# EasyEDA schematic SCH_OpenOllie_2026-02-20.json
TITLE: OO_CHRG; REV: 1; Date: 2025-11-22; Sheet: 1/1; Drawn By: Ellie; Company: EPU-LABS
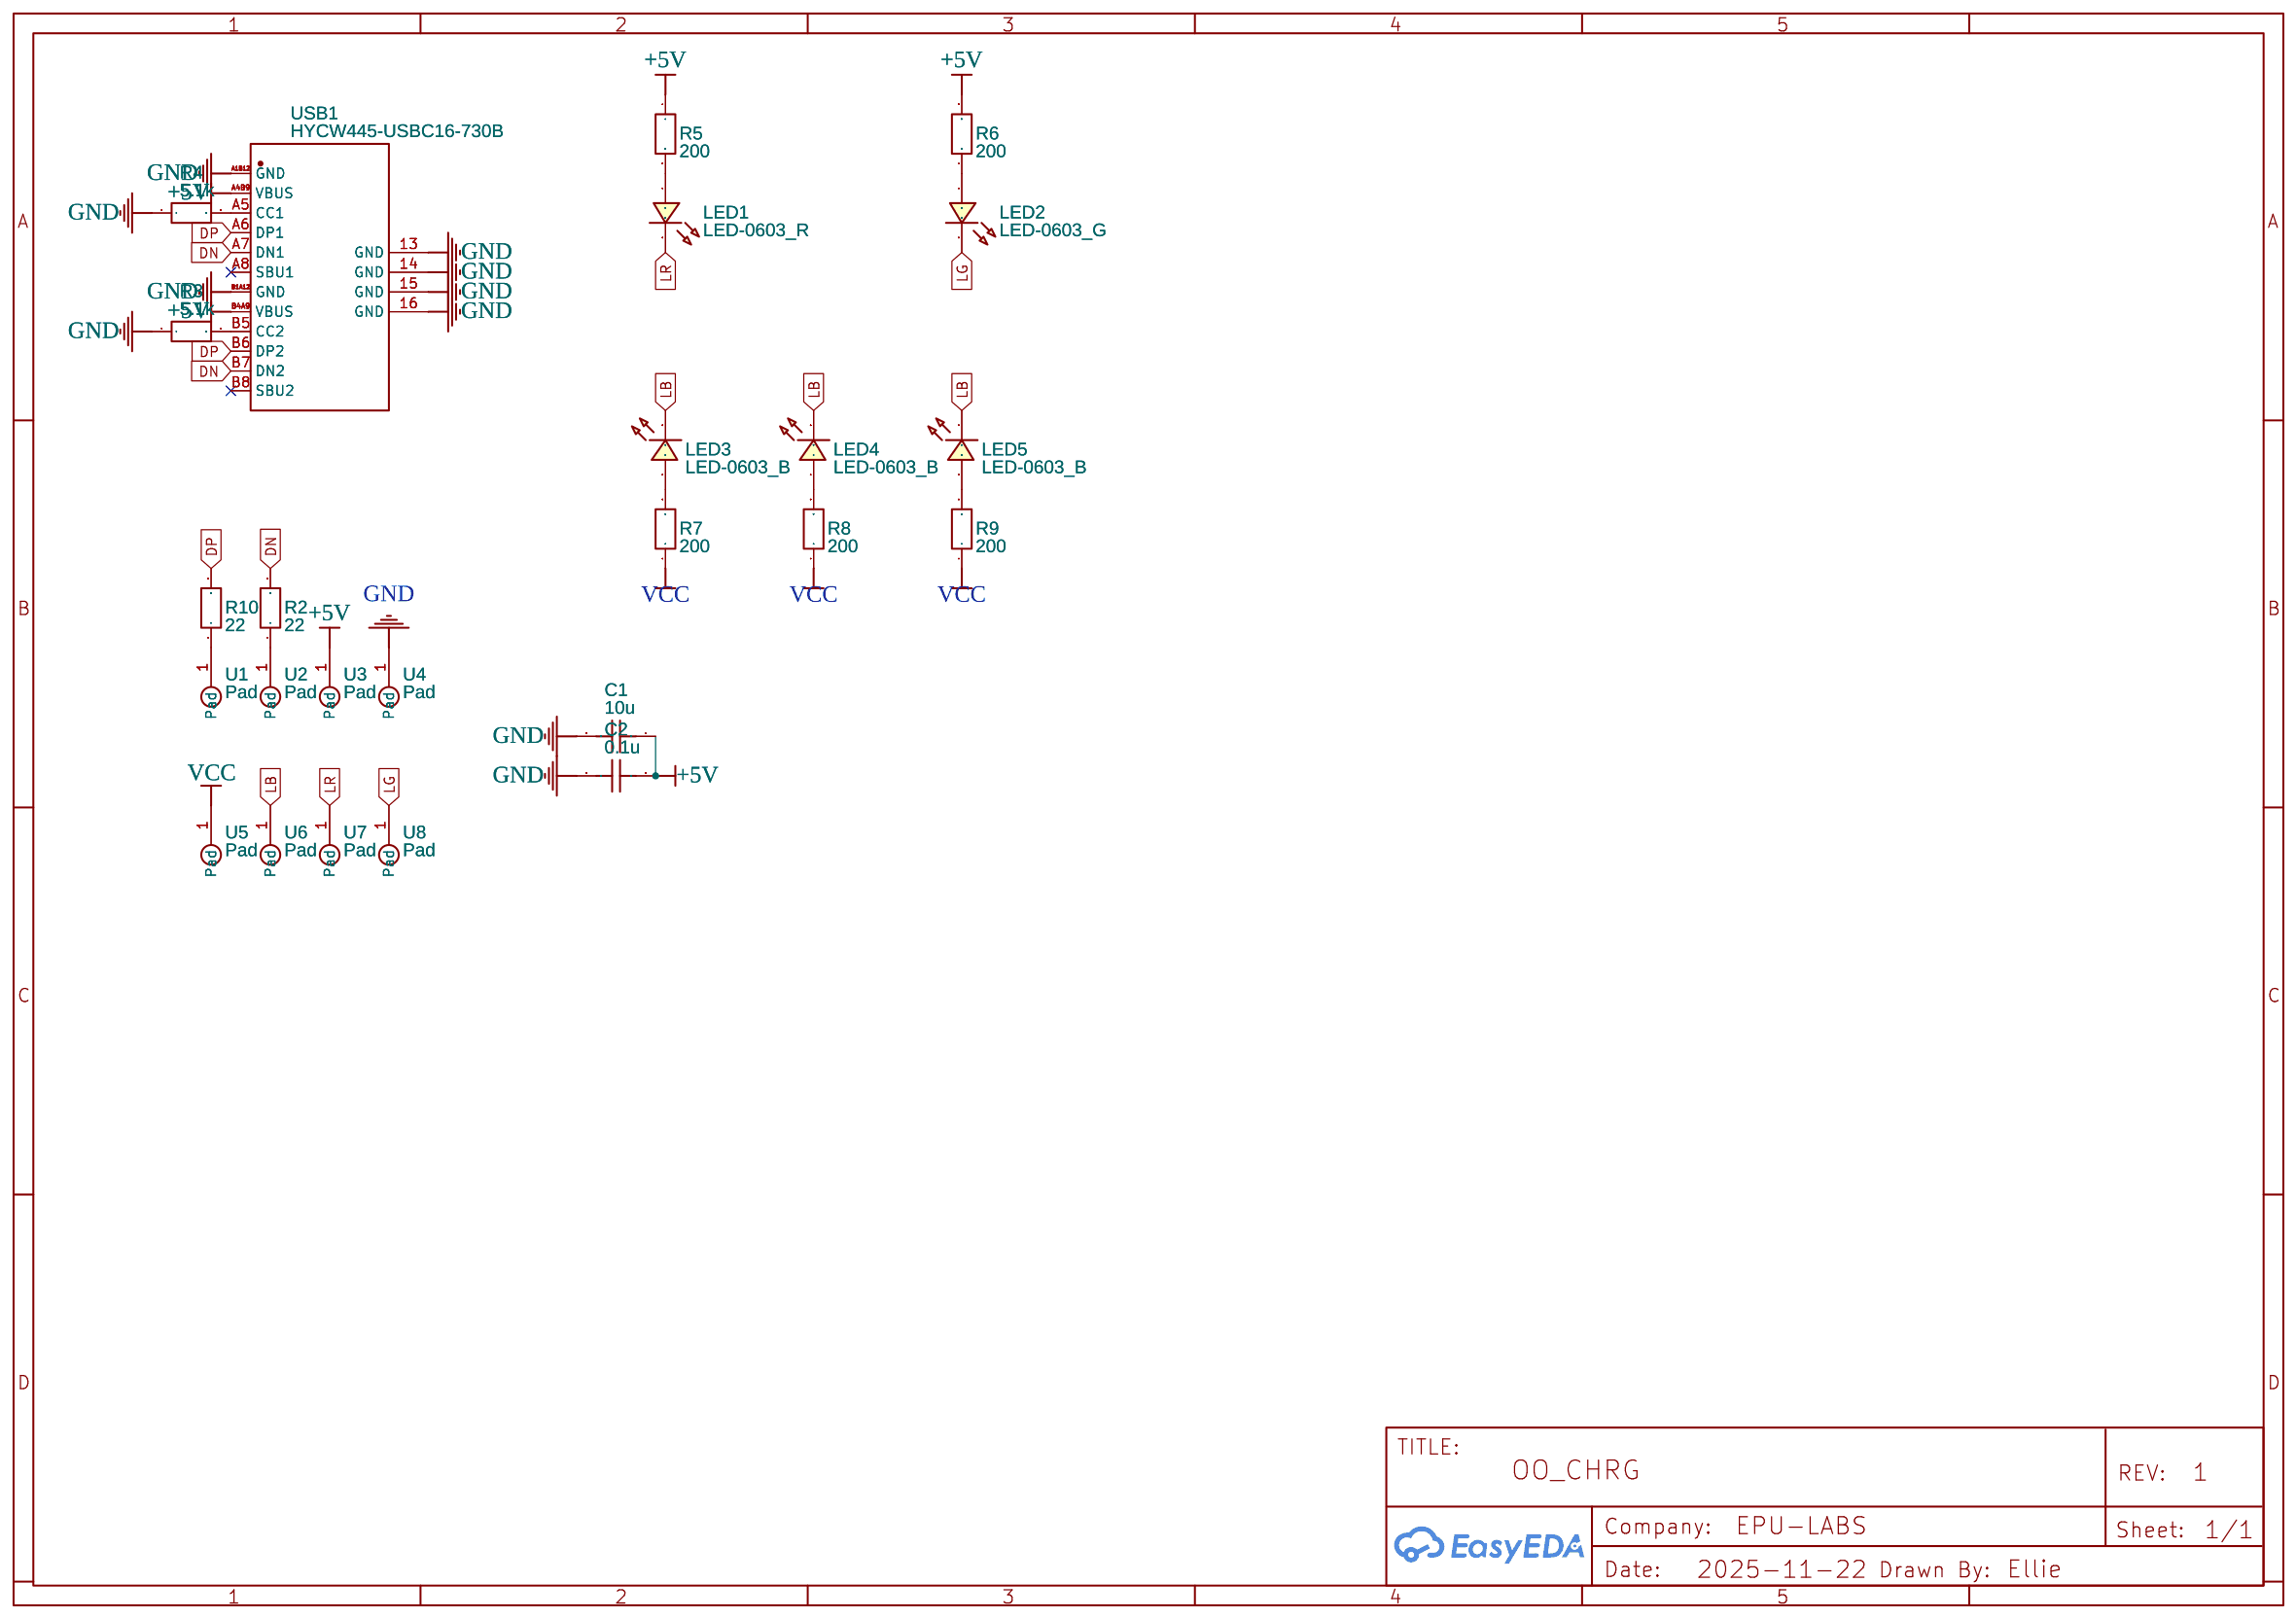
[diagram p0: schematic sheet]

## Parts
C1  10u  [C0603]
C2  0.1u  [C0402]
LED1  LED-0603_R  [LED0603_RED]
LED2  LED-0603_G  [LED0603_GREEN]
LED3  LED-0603_B  [LED0603_BLUE]
LED4  LED-0603_B  [LED0603_BLUE]
LED5  LED-0603_B  [LED0603_BLUE]
R2  22  [R0402]
R3  5.1k  [R0402]
R4  5.1k  [R0402]
R5  200  [R0402]
R6  200  [R0402]
R7  200  [R0402]
R8  200  [R0402]
R9  200  [R0402]
R10  22  [R0402]
U1  Pad  [PADPAD]
U2  Pad  [PADPAD]
U3  Pad  [PADPAD]
U4  Pad  [PADPAD]
U5  Pad  [PADPAD]
U6  Pad  [PADPAD]
U7  Pad  [PADPAD]
U8  Pad  [PADPAD]
USB1  HYCW445-USBC16-730B  [USB-TYPE-C-SMD_TYPE-C-16P-USB616FC]

## Library data of the parts
C1 = C_0805_US: Contributor: LCEDA_Lib
C2 = C_0402_US: Contributor: LCEDA_Lib
LED1 = LED-0603_R: Manufacturer: EVERLIGHT(台湾亿光); Manufacturer Part: 19-217/R6C-AL1M2VY/3T; Supplier Part: C72044; Supplier: LCSC; Contributor: LCEDA_01
LED2 = LED-0603_G: Manufacturer: EVERLIGHT(台湾亿光); Manufacturer Part: 19-217/GHC-YR1S2/3T; Supplier Part: C72043; Supplier: LCSC; Contributor: LCEDA_Lib
LED3-LED5 = LED-0603_B: Manufacturer: EVERLIGHT(台湾亿光); Manufacturer Part: 19-217/BHC-ZL1M2RY/3T; Supplier Part: C72041; Supplier: LCSC; Contributor: LCEDA_01
R2-R10 = R_0603_EU: Contributor: LCEDA_Lib
U1-U8 = Pad: Contributor: ianw86
USB1 = HYCW445-USBC16-730B: Supplier: LCSC; Supplier Part: C42400246; Manufacturer: 华宇创; Contributor: lcsc; JLCPCB Part Class: Extended Part

## Nets
+5V: C1.1 C2.2 R5.1 R6.2 U3.1(Pad) USB1.A4B9(VBUS) USB1.B4A9(VBUS)
GND: C1.2 C2.1 R3.1 R4.1 U4.1(Pad) USB1.13(GND) USB1.14(GND) USB1.15(GND) USB1.16(GND) USB1.A1B12(GND) USB1.B1A12(GND)
VCC: R7.1 R8.1 R9.1 U5.1(Pad)
DN: R2.2 USB1.A7(DN1) USB1.B7(DN2)
DP: R10.2 USB1.A6(DP1) USB1.B6(DP2)
LB: LED3.2 LED4.2 LED5.2 U6.1(Pad)
LG: LED2.2 U8.1(Pad)
LR: LED1.2 U7.1(Pad)
Net-(LED1-1): LED1.1 R5.2
Net-(LED2-1): LED2.1 R6.1
Net-(LED3-1): LED3.1 R7.2
Net-(LED4-1): LED4.1 R8.2
Net-(LED5-1): LED5.1 R9.2
Net-(R2-1): R2.1 U2.1(Pad)
Net-(R3-2): R3.2 USB1.B5(CC2)
Net-(R4-2): R4.2 USB1.A5(CC1)
Net-(R10-1): R10.1 U1.1(Pad)

Not connected (* = marked no-connect by the designer): USB1 A8(SBU1)* B8(SBU2)*
